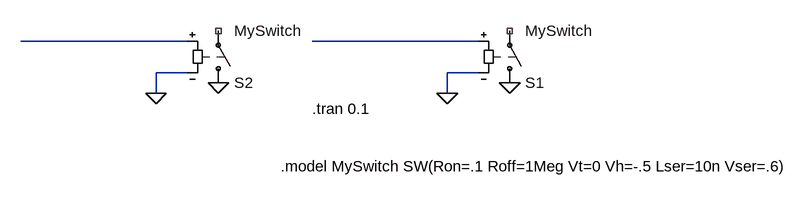
[diagram p0: schematic Draft6.asc]
Draft6.asc, the LTspice schematic file:
Version 4.1
SHEET 1 880 680
WIRE -288 128 -544 128
WIRE 160 128 -96 128
WIRE -288 176 -336 176
WIRE 160 176 112 176
WIRE -336 208 -336 176
WIRE 112 208 112 176
FLAG 208 192 0
FLAG 112 208 0
FLAG -240 192 0
FLAG -336 208 0
SYMBOL sw 208 208 M180
SYMATTR InstName S1
SYMATTR Value MySwitch
SYMBOL sw -240 208 M180
SYMATTR InstName S2
SYMATTR Value MySwitch
TEXT -96 232 Left 2 !.tran 0.1
TEXT -144 320 Left 2 !.model MySwitch SW(Ron=.1 Roff=1Meg Vt=0 Vh=-.5 Lser=10n Vser=.6)

The netlist it stands for:
* Draft6.asc
S1 0 NC_01 N002 0 MySwitch
S2 0 NC_02 N001 0 MySwitch
.tran 0.1
.model MySwitch SW(Ron=.1 Roff=1Meg Vt=0 Vh=-.5 Lser=10n Vser=.6)
.backanno
.end